# EAGLE design motor_dora (EAGLE 9.6.2)
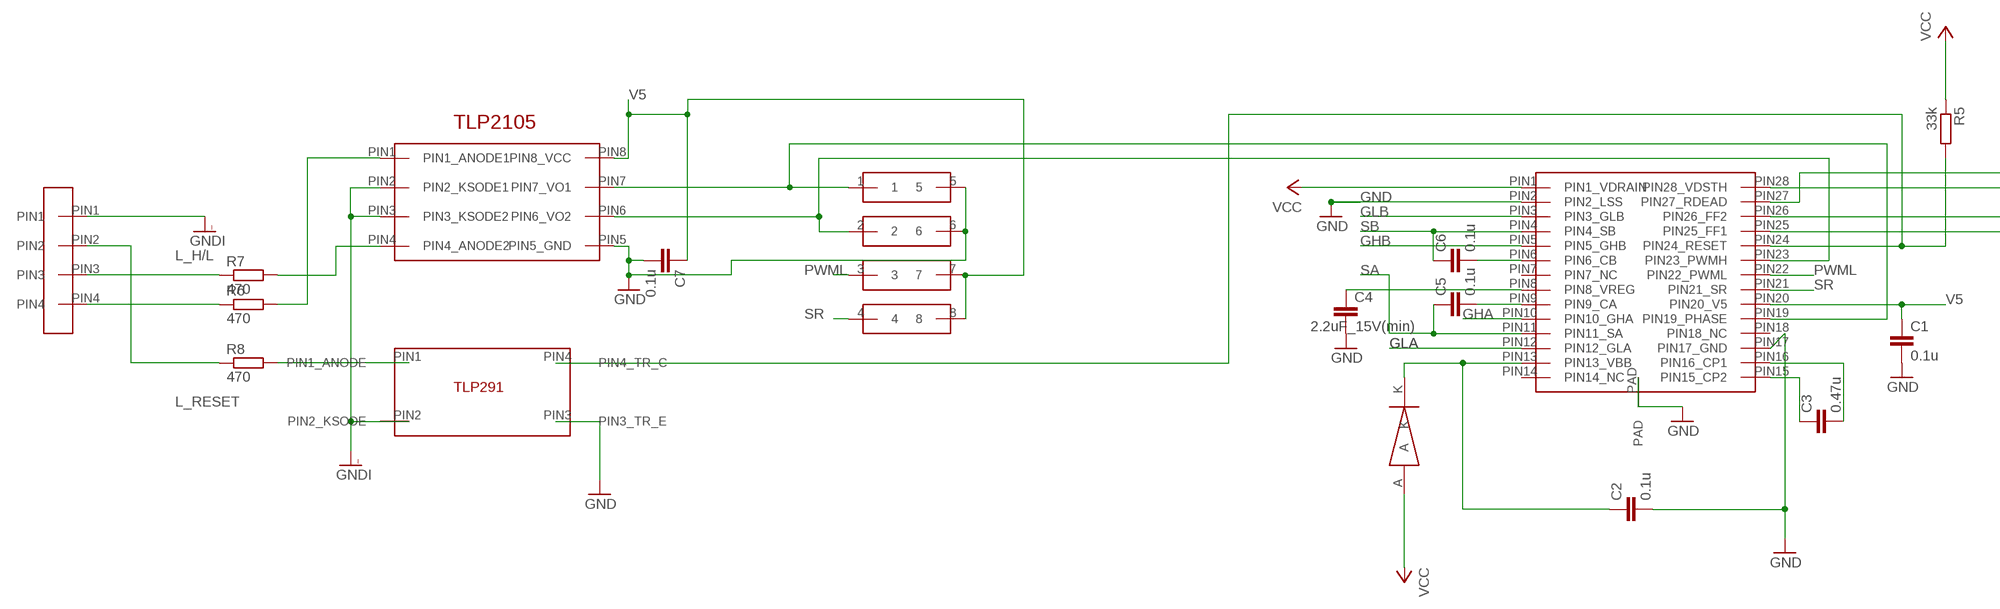
[diagram p0: schematic, sheet 1, part 1 of 2]
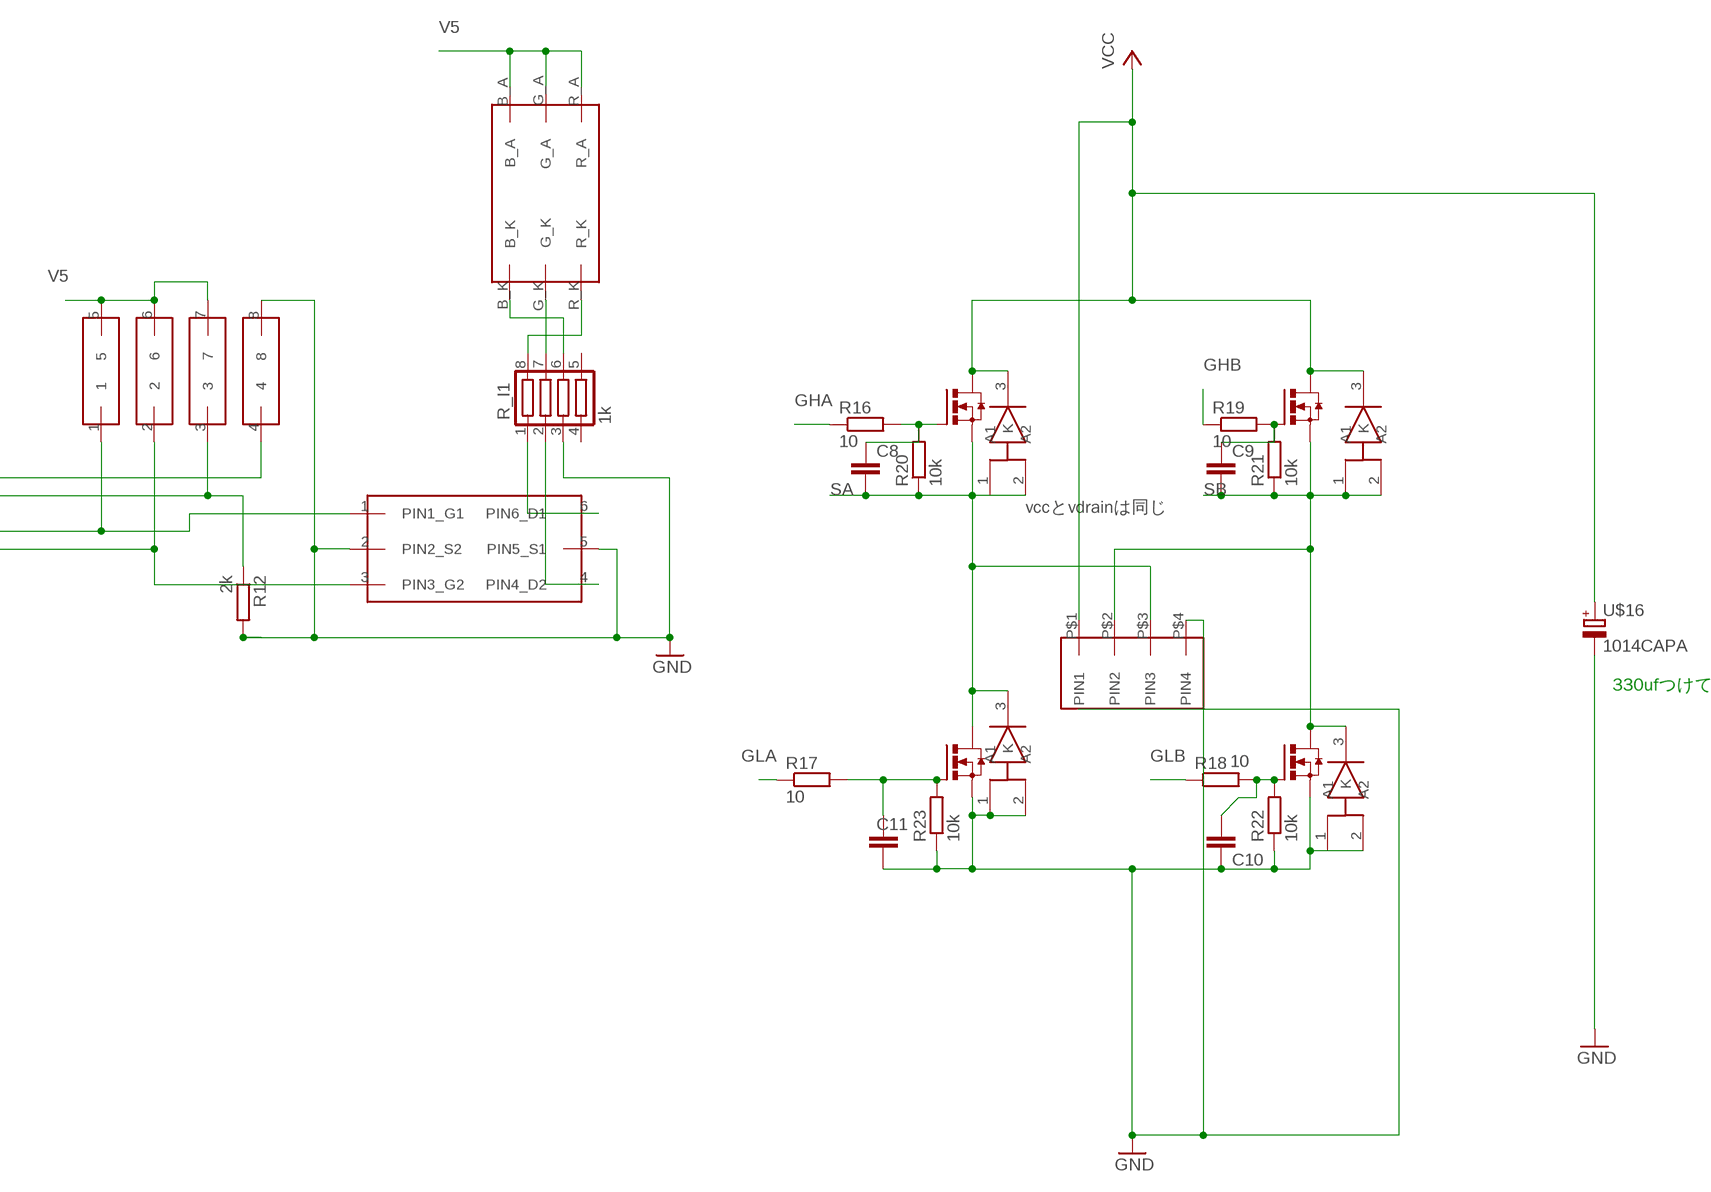
[diagram p1: schematic, sheet 1, part 2 of 2]

## Parts
C1  0.1u  C-EUC2012  [C2012]
C2  0.1u  C-EUC2012  [C2012]
C3  0.47u  C-EUC2012  [C2012]
C4  2.2uF_15V(min)  C-EUC2012  [C2012]
C5  0.1u  C-EUC2012  [C2012]
C6  0.1u  C-EUC2012  [C2012]
C7  0.1u  C-EUC2012  [C2012]
C8  C-EUC2012  [C2012]
C9  C-EUC2012  [C2012]
C10  C-EUC2012  [C2012]
C11  C-EUC2012  [C2012]
R5  33k  R-EU_R2012  [R2012]
R6  470  R-EU_R2012  [R2012]
R7  470  R-EU_R2012  [R2012]
R8  470  R-EU_R2012  [R2012]
R12  2k  R-EU_R2012  [R2012]
R16  10  R-EU_R2012  [R2012]
R17  10  R-EU_R2012  [R2012]
R18  10  R-EU_R2012  [R2012]
R19  10  R-EU_R2012  [R2012]
R20  10k  R-EU_R2012  [R2012]
R21  10k  R-EU_R2012  [R2012]
R22  10k  R-EU_R2012  [R2012]
R23  10k  R-EU_R2012  [R2012]
R_I1  1k  R_SHUGOU  [0603X4RESISTOR]
U$1  A3921  [A3921]
U$2  TLP2105  [TLP2105]
U$3  TLP291  [TLP291]
U$4  RGB_LED  [RGB_LED]
U$5  10k  1005X4RESISTOR  [1005X4RESISTOR]
U$6  10k  1005X4RESISTOR  [1005X4RESISTOR]
U$7  SBR10M100P5Q  [POWERDI_5]
U$8  IPD034N06N3G  [TO252]
U$9  IPD034N06N3G  [TO252]
U$10  IPD034N06N3G  [TO252]
U$11  IPD034N06N3G  [TO252]
U$12  SBR10M100P5Q  [POWERDI_5]
U$13  DF1B_L_4P  [DF1B_L_4P]
U$14  VL_4P  [VL_4P]
U$15  SBR10M100P5Q  [POWERDI_5]
U$16  1014CAPA  [1014CAPA]
U$17  SMD_DAIOD  [SMD_DAIOD]
U$18  SSOT6_FET  [SSOT6_FET]
U$19  SBR10M100P5Q  [POWERDI_5]

## Nets
GHA: R16.1 U$1.PIN10(PIN10_GHA)
GHB: R19.1 U$1.PIN5(PIN5_GHB)
GLA: R17.1 U$1.PIN12(PIN12_GLA)
GLB: R18.1 U$1.PIN3(PIN3_GLB)
GND: C1.2 C2.2 C4.2 C7.2 C10.2 C11.2 R12.2 R22.1 R23.1 R_I1.3 U$1.PAD U$1.PIN2(PIN2_LSS) U$1.PIN17(PIN17_GND) U$2.PIN5(PIN5_GND) U$3.PIN3(PIN3_TR_E) U$5.5 U$5.6 U$6.8 U$7.1(A1) U$7.2(A2) U$10.PIN3(PIN3_S) U$11.PIN3(PIN3_S) U$12.1(A1) U$12.2(A2) U$14.P$4(PIN4) U$16.- U$18.2(PIN2_S2) U$18.5(PIN5_S1)
GNDI: U$2.PIN2(PIN2_KSODE1) U$2.PIN3(PIN3_KSODE2) U$3.PIN2(PIN2_KSODE) U$13.PIN1
L_H/L: R7.1 U$13.PIN3
L_RESET: R8.1 U$13.PIN2
N$1: C2.1 U$1.PIN13(PIN13_VBB) U$17.K
N$2: R6.1 U$13.PIN4
N$3: R6.2 U$2.PIN1(PIN1_ANODE1)
N$4: C3.1 U$1.PIN15(PIN15_CP2)
N$5: U$1.PIN27(PIN27_RDEAD) U$6.4
N$6: R7.2 U$2.PIN4(PIN4_ANODE2)
N$7: R5.2 U$1.PIN24(PIN24_RESET) U$3.PIN4(PIN4_TR_C)
N$8: U$1.PIN23(PIN23_PWMH) U$2.PIN6(PIN6_VO2) U$5.2
N$9: U$1.PIN26(PIN26_FF2) U$6.1 U$18.1(PIN1_G1)
N$10: R8.2 U$3.PIN1(PIN1_ANODE)
N$11: C3.2 U$1.PIN16(PIN16_CP1)
N$12: U$1.PIN25(PIN25_FF1) U$6.2 U$18.3(PIN3_G2)
N$13: C4.1 U$1.PIN8(PIN8_VREG)
N$14: R_I1.7 U$4.G_K
N$15: R12.1 U$1.PIN28(PIN28_VDSTH) U$6.3
N$16: C6.2 U$1.PIN6(PIN6_CB)
N$17: C5.2 U$1.PIN9(PIN9_CA)
N$18: R_I1.2 U$18.4(PIN4_D2)
N$19: R_I1.8 U$4.R_K
N$20: R_I1.6 U$4.B_K
N$21: R_I1.1 U$18.6(PIN6_D1)
N$24: C8.1 R16.2 R20.2 U$8.PIN1(PIN1_G)
N$25: C9.1 R19.2 R21.2 U$9.PIN1(PIN1_G)
N$26: C11.1 R17.2 R23.2 U$10.PIN1(PIN1_G)
N$27: C10.1 R18.2 R22.2 U$11.PIN1(PIN1_G)
N$29: U$1.PIN19(PIN19_PHASE) U$2.PIN7(PIN7_VO1) U$5.1
PWML: U$1.PIN22(PIN22_PWML) U$5.3
SA: C5.1 C8.2 R20.1 U$1.PIN11(PIN11_SA) U$7.3(K) U$8.PIN3(PIN3_S) U$10.PIN2(PIN2_D) U$14.P$3(PIN3) U$19.1(A1) U$19.2(A2)
SB: C6.1 C9.2 R21.1 U$1.PIN4(PIN4_SB) U$9.PIN3(PIN3_S) U$11.PIN2(PIN2_D) U$12.3(K) U$14.P$2(PIN2) U$15.1(A1) U$15.2(A2)
SR: U$1.PIN21(PIN21_SR) U$5.4
V5: C1.1 C7.1 U$1.PIN20(PIN20_V5) U$2.PIN8(PIN8_VCC) U$4.B_A U$4.G_A U$4.R_A U$5.7 U$5.8 U$6.5 U$6.6 U$6.7
VCC: R5.1 U$1.PIN1(PIN1_VDRAIN) U$8.PIN2(PIN2_D) U$9.PIN2(PIN2_D) U$14.P$1(PIN1) U$15.3(K) U$16.+ U$17.A U$19.3(K)
Unconnected: R_I1.4 R_I1.5 U$1.PIN7(PIN7_NC) U$1.PIN14(PIN14_NC) U$1.PIN18(PIN18_NC)

## Notes on the sheet
- vccとvdrainは同じ
- 330ufつけて

## Library data of the parts
C1-C11 = rcl:C-EU: CAPACITOR, European symbol; SPICEPREFIX: C
R5-R8 R12 R16-R23 = rcl:R-EU_: RESISTOR, European symbol; SPICEPREFIX: R
R_I1 = user_rcl:R_SHUGOU
U$1 = user:A3921
U$2 = user:TLP2105
U$3 = user:TLP291
U$4 = user:RGB_LED
U$5 U$6 = user:1005X4RESISTOR
U$7 U$12 U$15 U$19 = user_diode:SBR10M100P5Q: digikeyに売ってるスーパーバリアダイオード 100V 10A
U$8-U$11 = user_tr_fet_igbt:IPD034N06N3G: 絶対最大定格：60V100A 買う場所：rsコンポーネンツ 通販コード：825-9168 値段が1つ160円くらいで高い！！！
U$13 = user:DF1B_L_4P
U$14 = user:VL_4P
U$16 = user:1014CAPA
U$17 = user:SMD_DAIOD
U$18 = user:SSOT6_FET

## Board
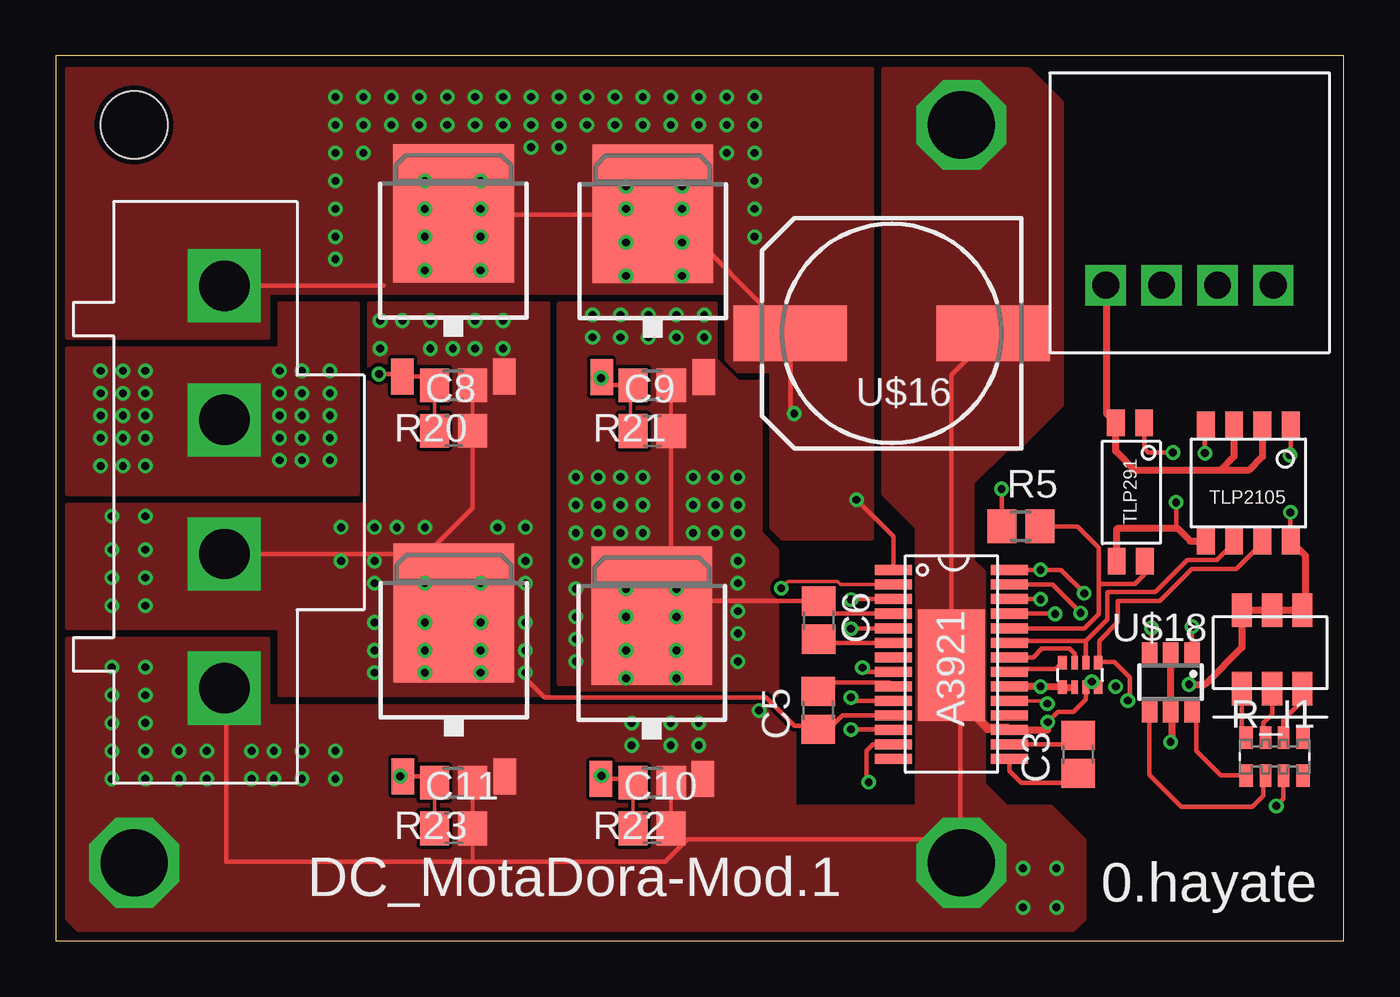
[diagram p2: board, top side]
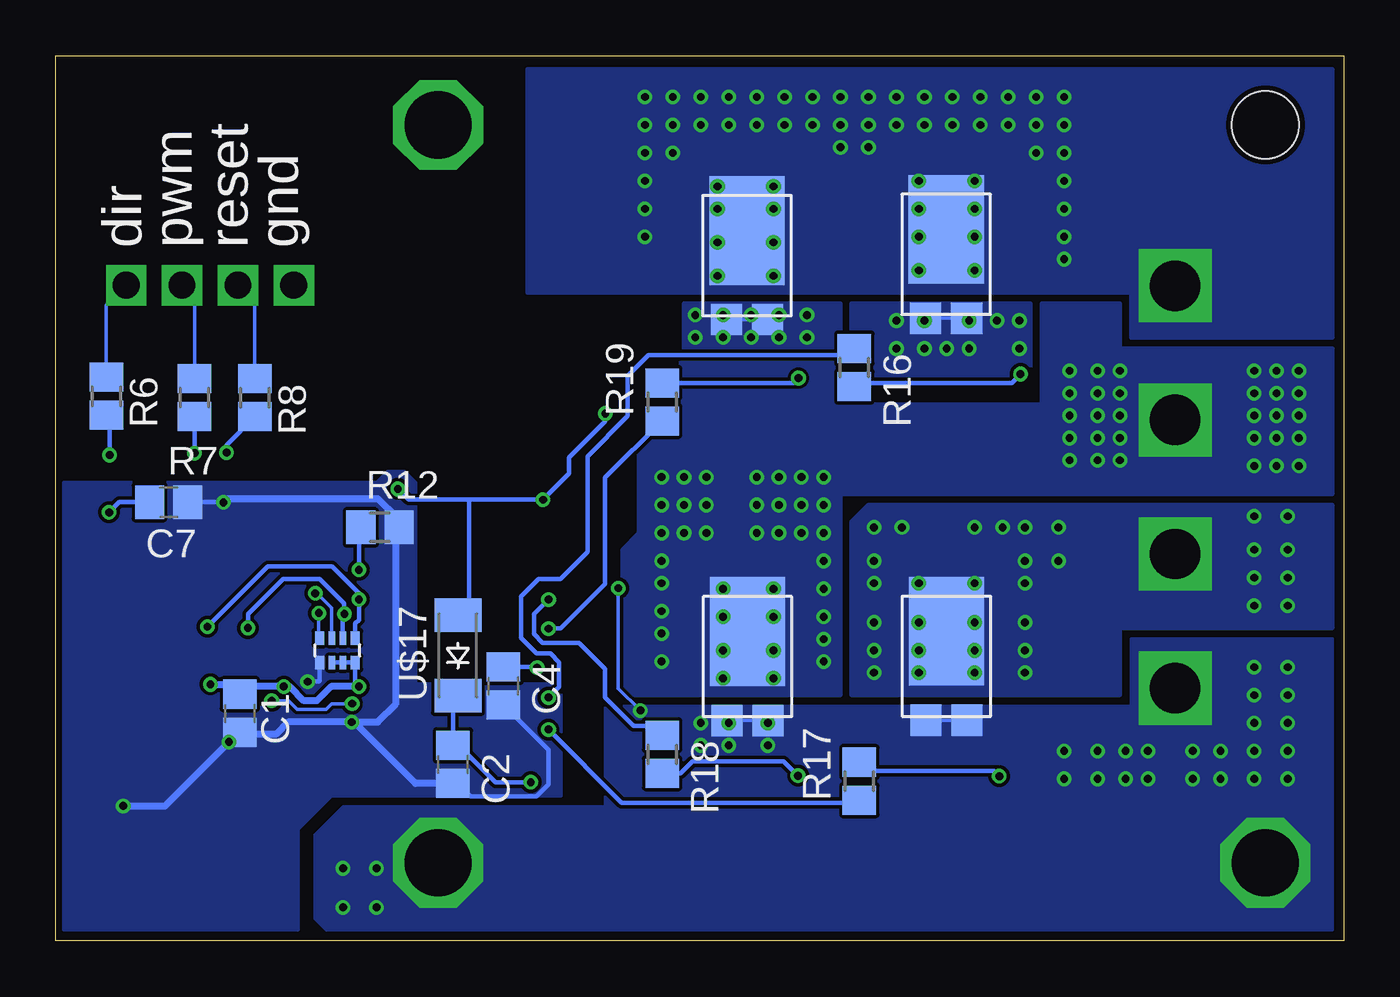
[diagram p3: board, bottom side, seen from below]

Size 57.59 x 39.59 mm. Coordinates in mm from the lower left corner, seen from the top.
Outline: 0,0 57.59,0 57.59,39.59 0,39.59 0,0
Copper layers (1*16): Top 0.035mm / dielectric 1.5mm / Bottom 0.035mm
Design rules "SeeedStudio_2layer_DRU_no_angle_20140221": minimum track width 6mil, minimum drill 12mil, track to track 6mil, track to pad 6mil, pad to pad 6mil, via to via 6mil, smd to smd 0mil, copper to edge 10mil, drill to drill 10mil, minimum pad ring 10mil, minimum via ring 6mil, stop-mask expansion 2mil, vias tented up to drill 100mil, thermal gap 10mil
Holes 3 mm at 3.5,36.5

### Footprints (pad centres in the part's own frame; a part is rotated, then mirrored left to right if it is on the bottom)
C2012 = smd 1.3 x 1.5: 1 -0.85,0; 2 0.85,0
R2012 = smd 1.3 x 1.5: 1 -0.85,0; 2 0.85,0
0603X4RESISTOR = smd 0.6 x 1: 1 -1.275,-0.85; 4 1.275,-0.85; 5 1.275,0.85; 8 -1.275,0.85 | smd 0.5 x 1: 2 -0.4,-0.85; 3 0.4,-0.85; 6 0.4,0.85; 7 -0.4,0.85
A3921 = smd 5 x 3: PAD 4.906,1.942 | smd 0.45 x 1.65: PIN1 0.65,-0.65; PIN2 1.3,-0.65; PIN3 1.95,-0.65; PIN4 2.6,-0.65; PIN5 3.25,-0.65; PIN6 3.9,-0.65; PIN7 4.55,-0.65; PIN8 5.2,-0.65; PIN9 5.85,-0.65; PIN10 6.5,-0.65; PIN11 7.15,-0.65; PIN12 7.8,-0.65; PIN13 8.45,-0.65; PIN14 9.1,-0.65; PIN15 9.1,4.55; PIN16 8.45,4.55; PIN17 7.8,4.55; PIN18 7.15,4.55; PIN19 6.5,4.55; PIN20 5.85,4.55; PIN21 5.2,4.55; PIN22 4.55,4.55; PIN23 3.9,4.55; PIN24 3.25,4.55; PIN25 2.6,4.55; PIN26 1.95,4.55; PIN27 1.3,4.55; PIN28 0.65,4.55
TLP2105 = smd 0.8 x 1.2: PIN1 0.65,-4.57; PIN2 1.92,-4.57; PIN3 3.19,-4.57; PIN4 4.46,-4.57; PIN5 4.46,0.62; PIN6 3.19,0.62; PIN7 1.92,0.62; PIN8 0.65,0.62
TLP291 = smd 1.2 x 0.8: PIN1 0.411,-0.862; PIN2 0.411,-2.132; PIN3 6.601,-2.092; PIN4 6.601,-0.822
RGB_LED = smd 1.5 x 0.9: B_A 3.5,-2.7; B_K 0,-2.7; G_A 3.5,-1.35; G_K 0,-1.35; R_A 3.5,0; R_K 0,0
1005X4RESISTOR = smd 0.4 x 0.6: 1 0.2,-0.8; 4 1.8,-0.8; 5 0.2,0.3; 8 1.8,0.3 | smd 0.3 x 0.6: 2 0.75,-0.8; 3 1.25,-0.8; 6 0.75,0.3; 7 1.25,0.3
POWERDI_5 = smd 1.39 x 1.4: 1 1.063,-0.177; 2 2.903,-0.177 | smd 3.36 x 4.86: 3 1.983,3.805
TO252 = smd 1 x 1.6: PIN1 -2.28,-4.8; PIN3 2.28,-4.8 | smd 5.4 x 6.2: PIN2 0,2.5
DF1B_L_4P = drill 1.2 square: PIN1 2.5,-9.5; PIN2 5,-9.5; PIN3 7.5,-9.5; PIN4 10,-9.5
VL_4P = drill 2.25 square: P$1 3.75,-3.25; P$2 9.75,-3.25; P$3 15.75,-3.25; P$4 21.75,-3.25
1014CAPA = smd 5.079 x 2.5: + 4.531,0; - -4.531,0
SMD_DAIOD = smd 1.5 x 2.1: A 1.8,0; K -1.8,0
SSOT6_FET = smd 0.69 x 0.99: 1 -0.95,-1.3; 2 0,-1.3; 3 0.95,-1.3; 4 0.95,1.3; 5 0,1.3; 6 -0.95,1.3

### Placement (x,y rotation side)
C1  49.37,10.19 270 bottom
C2  39.83,7.9 270 bottom
C3  45.72,8.35 90 top
C4  37.57,11.41 270 bottom
C5  34.1,10.31 90 top
C6  34.11,14.35 270 top
C7  52.55,19.63 0 bottom
C8  17.78,22.83 0 top
C9  26.67,22.81 0 top
C10  26.66,5.04 0 top
C11  17.78,5.04 0 top
R5  43.15,18.55 0 top
R6  55.33,24.37 270 bottom
R7  51.39,24.31 270 bottom
R8  48.69,24.3 270 bottom
R12  43.1,18.5 0 bottom
R16  21.88,25.65 270 bottom
R17  21.66,7.15 90 bottom
R18  30.48,8.35 270 bottom
R19  30.48,24.11 90 bottom
R20  17.78,24.86 180 top
R21  26.67,24.86 180 top
R22  26.67,7.08 180 top
R23  17.78,7.08 180 top
R_I1  54.5,8.25 0 top
U$1  38.1,17.24 270 top
U$2  55.88,18.51 180 top
U$3  49.53,23.59 270 top
U$4  53.04,11.29 90 top
U$5  46.81,11.65 180 top
U$6  44,12.75 180 bottom
U$7  19.75,10.05 0 bottom
U$8  17.78,30.05 0 top
U$9  26.69,30.02 0 top
U$10  17.8,12.17 0 top
U$11  26.65,12.05 0 top
U$12  28.64,10.04 0 bottom
U$13  44.45,38.83 0 top
U$14  10.78,33.06 270 top
U$15  28.67,27.97 0 bottom
U$16  37.38,27.18 180 top
U$17  39.61,12.77 90 bottom
U$18  49.86,11.57 180 top
U$19  19.76,28.03 0 bottom

### Tracks (layer width: path | path; a pad name or v marks a point on that pad's centre or on a via)
GHA  (via drill 0.35)
  Top 0.2: U$1.PIN10 35.71,10.74 v35.56,10.89
  Bottom 0.2: R16.1 22.18,26.2 31.09,26.2 32.02,25.27 32.02,23.47 33.81,21.68 33.81,17.4 35.02,16.19 36.01,16.19 36.79,15.41 36.79,13.56 36.08,12.85 35.47,12.85 35.08,12.46 35.08,11.37 v35.56,10.89
GHB  (via drill 0.35)
  Top 0.2: U$1.PIN5 35.58,13.99 v35.56,13.97
  Bottom 0.2: R19.1 33.02,20.72 33.02,15.97 35.02,13.97 v35.56,13.97
GLA  (via drill 0.35)
  Top 0.2: U$1.PIN12 37.43,9.46 v35.56,9.46
  Bottom 0.2: R17.1 21.77,6.19 32.29,6.19 v35.56,9.46
GLB  (via drill 0.35)
  Top 0.2: U$1.PIN3 35.58,15.29 v35.56,15.27
  Bottom 0.2: v35.56,15.27 36.21,14.62 36.21,13.73 35.82,13.34 34.2,13.34 33.02,12.16 33.02,10.89 31.75,9.62 30.9,9.62 R18.1
GND  (via drill 0.35, 3)
  Top 0.152: R22.1 C10.2 28.01,4.54 28.25,4.54 | R23.1 C11.2 18.63,3.66 18.75,3.54 | U$5.5 46.36,11.6 v46.33,11.6 46.31,11.6 U$5.6 | U$1.PIN2 35.09,15.94 34.95,16.08 32.74,16.08 v32.44,15.78
  Top 0.2: v50.1,19.62 50.1,18.52 50.18,18.44 | U$16.- 40.04,25.31 40.04,14.5 40.04,12.5 | 40.04,12.5 40.04,12.16 | U$14.P$4 7.62,11.22 7.62,3.54 18.75,3.54 27.25,3.54 28.25,4.54 40.46,4.54 40.46,12.08 40.04,12.5
  Top 0.203: R_I1.3 54.9,6.36 v54.58,6.04 | v44.36,9.79 44.82,10.25 45.51,10.25 46.06,10.8 U$5.6
  Top 0.305: U$1.PIN17 44.36,9.44 v44.36,9.79 | U$2.PIN5 50.73,17.89 50.18,18.44 47.45,18.44 47.44,18.43 U$3.PIN3 | v49.85,8.9 49.9,8.95 49.9,10.23 U$18.5 U$18.2
  Top 0.406: U$1.PIN17 42.58,9.51 41.68,9.51 40.04,11.14 40.04,12.16 U$1.PAD
  Bottom 0.152: U$7.2 U$7.1 | U$12.2 U$12.1 | v32.44,15.78 32.44,11.3 v31.45,10.31
  Bottom 0.2: C7.2 v50.11,19.63 v50.1,19.62 | C4.2 35.56,8.55 35.56,7 36.09,6.47 39.05,6.47 39.63,7.05 C2.2
  Bottom 0.203: v46.33,11.6 45.83,11.6 45.8,11.63 U$6.8
  Bottom 0.305: 44.25,9.79 v44.36,9.79 47.21,9.79 47.75,9.25 49.28,9.25 C1.2 49.81,8.9 v49.85,8.9 52.71,6.04 v54.58,6.04 | 44.25,9.79 43.2,9.79 42.4,10.59 42.4,18.44 | R12.2 42.4,18.44 | 42.4,18.44 42.4,19 43.18,19.78 49.96,19.78 v50.11,19.63 | C2.2 41.51,7.05 44.25,9.79
  other vias: 40.5,3.5 3.5,3.5 40.5,36.5 2.5,12.25 2.5,11 2.5,9.75 2.5,8.5 2.5,7.25 4,12.25 4,11 4,9.75 4,8.5 4,7.25 5.5,8.5 6.75,8.5 6.75,7.25 5.5,7.25 9.75,8.5 9.75,7.25 11,7.25 11,8.5 12.5,8.5 12.5,7.25 8.75,7.25 8.75,8.5 25.75,9.75 27.5,9.75 25.75,8.75 27.5,8.75 28.75,8.75 28.75,9.75 43.25,3.25 44.75,3.25 44.75,1.5 43.25,1.5
  pour Top (no thermals): 9.5,13.5 0.5,13.5 0.5,1 1,0.5 45.5,0.5 46,1 46,4.5 44.5,6 42.5,6 41.5,7 41.5,16.5 41,17 41,20.5 42.5,22 43,22 45,24 45,37.5 43.5,39 37,39 37,20 38.5,18.5 38.5,6 33,6 33,10.5 9.5,10.5
  pour Bottom (no thermals): 0.5,13.5 0.5,0.5 45.5,0.5 45.75,0.75 46,1 46,4.75 44.75,6 44.5,6 42.5,6 33,6 33,9.5 33,10.5 9.5,10.5 9.5,13.5
  pour Bottom (no thermals): 46.75,0.5 57.25,0.5 57.25,20.5 43.25,20.5 42.75,21 42,21 41.5,20.5 41.5,11.5 35,11.5 35,6.5 45.25,6.5 46.75,5
GNDI
  Top 0.305: U$2.PIN3 52.69,21.67 52.07,21.05 | 52.07,21.05 48.26,21.05 47.4,21.91 U$3.PIN2 46.99,23.59 46.99,29.29 U$13.PIN1 | U$2.PIN2 53.96,21.67 53.34,21.05 52.07,21.05
L_H/L
  Bottom 0.152: U$13.PIN3 51.39,28.77 R7.1
L_RESET
  Bottom 0.152: U$13.PIN2 48.69,28.57 R8.1
N$1  (via drill 0.35)
  Top 0.2: v36.35,7.1 36.26,7.19 36.26,8.5 36.55,8.79 U$1.PIN13
  Bottom 0.2: v36.35,7.1 37.93,7.1 39.58,8.75 C2.1 39.83,10.75 U$17.K
N$2
  Bottom 0.152: U$13.PIN4 55.33,28.45 R6.1
N$3  (via drill 0.35)
  Top 0.2: U$2.PIN1 55.23,21.78 v55.19,21.74
  Bottom 0.2: R6.2 55.19,23.38 v55.19,21.74
N$4
  Top 0.2: C3.1 45.3,7.08 43.18,7.08 42.65,7.61 U$1.PIN15
N$5  (via drill 0.35)
  Top 0.2: v45.83,14.67 44.56,15.94 U$1.PIN27
  Bottom 0.152: v45.83,14.67 45.83,13.58 U$6.4
N$6  (via drill 0.35)
  Top 0.2: v51.39,21.82 51.39,23.05 U$2.PIN4
  Bottom 0.2: R7.2 v51.39,21.82
N$7
  Top 0.2: U$1.PIN24 45.71,13.99 45.72,13.98 45.99,13.98 46.64,14.63 46.64,15.96 46.65,15.97 | 46.65,15.97 48.26,15.97 48.71,16.42 U$3.PIN4 | R5.2 45.68,18.55 46.65,17.58 46.65,15.97
N$8
  Top 0.2: U$2.PIN6 52.69,17.8 51.92,17.04 50.6,17.04 49.18,15.62 47.05,15.62 47.02,15.59 47.02,14.39 46.06,13.43 | U$1.PIN23 42.74,13.43 46.06,13.43 | 46.06,13.43 46.06,12.75 46.06,12.49 U$5.2
N$9  (via drill 0.35)
  Top 0.2: U$1.PIN26 v44.03,15.29 v44.04,15.28 | v50.81,14.06 U$18.1
  Bottom 0.2: v50.81,14.06 48.12,16.75 45.24,16.75 44.04,15.55 v44.04,15.28 v44.03,15.27 44.03,14.37 44.2,14.2 U$6.1
N$10  (via drill 0.35)
  Top 0.2: v49.96,21.85 48.86,21.85 48.67,22.04 U$3.PIN1
  Bottom 0.2: R8.2 49.96,22.18 v49.96,21.85
N$11
  Top 0.2: U$1.PIN16 43.74,8.79 45.31,8.79 C3.2
N$12  (via drill 0.35)
  Top 0.152: v49,14 49,12.96 U$18.3
  Top 0.2: U$1.PIN25 v44.68,14.64 v44.69,14.63
  Bottom 0.2: v49,14 49,14.62 47.42,16.2 45.8,16.2 44.69,15.09 v44.69,14.63 44.76,14.56 U$6.2
N$13  (via drill 0.35)
  Top 0.2: U$1.PIN8 36.25,12.04 v36.07,12.22
  Bottom 0.2: C4.1 36.11,12.26 v36.07,12.22
N$14
  Top 0.203: U$4.G_K 54.39,10.14 54,9.75 54,9.2 R_I1.7
N$15  (via drill 0.35)
  Top 0.2: U$1.PIN28 v44.03,16.59 v44.04,16.6 44.95,16.6 v45.99,15.56 v45.99,15.55
  Bottom 0.152: U$6.3 45.25,14.89 45.91,15.55 v45.99,15.55
  Bottom 0.2: v44.04,16.6 44.04,18.41 R12.1
N$16
  Top 0.2: U$1.PIN6 34.27,13.34 C6.2
N$17
  Top 0.2: U$1.PIN9 37.28,11.56 34.5,11.56 C5.2
N$18
  Top 0.152: 54,7.3 R_I1.2
  Top 0.2: U$18.4 48.91,7.43 50.34,6 53.34,6
  Top 0.203: 53.34,6 53.5,6 54,6.5 54,7.3
N$19
  Top 0.203: U$4.R_K 53.04,9.29 R_I1.8
N$20
  Top 0.203: U$4.B_K 55.74,10.74 54.9,9.9 R_I1.6
N$21
  Top 0.203: U$18.6 51,10.08 51,8.5 52.1,7.4 R_I1.1
N$24  (via drill 0.35)
  Top 0.152: R20.2 16.93,24.75 C8.1
  Top 0.2: v14.45,25.36 15.39,25.36 U$8.PIN1 16.43,25.25 16.93,24.75
  Bottom 0.2: R16.2 21.71,24.96 14.85,24.96 v14.45,25.36
N$25  (via drill 0.35)
  Top 0.152: C9.1 25.82,22.85 25.69,22.97 25.69,24.73 R21.2
  Top 0.2: R21.2 24.5,24.86 24.27,25.09 U$9.PIN1 v24.38,25.19 v24.38,25.18
  Bottom 0.2: R19.2 24.6,24.96 v24.38,25.18
N$26  (via drill 0.35)
  Top 0.152: R23.2 16.93,7 C11.1
  Top 0.2: v15.4,7.37 v15.41,7.36 U$10.PIN1 16.56,7.37 16.93,7
  Bottom 0.2: R17.2 21.28,7.62 15.65,7.62 v15.4,7.37
N$27  (via drill 0.35)
  Top 0.152: R22.2 C10.1
  Top 0.2: R22.2 25.65,7.25 U$11.PIN1 24.4,7.28 v24.4,7.39
  Bottom 0.2: R18.2 29.66,7.5 29.12,8.04 25.05,8.04 v24.4,7.39
N$29  (via drill 0.35)
  Top 0.152: U$1.PIN19 44.22,10.74 v44.34,10.62 | v47.94,10.75
  Top 0.2: U$2.PIN7 53.96,17.8 52.8,16.64 50.81,16.64 49.38,15.21 47.5,15.21 47.49,15.2 47.49,14.26 46.66,13.43 46.66,12.5 U$5.1 46.65,12.49 47.34,12.49 48.04,11.79 48.04,10.85 v47.94,10.75
  Bottom 0.152: v44.34,10.62 45.27,10.62 45.51,10.37 46.81,10.37 47.19,10.75 v47.94,10.75
PWML
  Top 0.2: U$1.PIN22 43.71,12.69 44.1,13.08 45.32,13.08 45.56,12.84 U$5.3
SA  (via drill 0.35)
  Top 0.152: R20.1 18.63,23
  Top 0.2: C5.1 34.26,9.62 | U$1.PIN11 35.17,10.09 34.7,9.62 34.26,9.62 | U$14.P$3 16.58,17.31 18.63,19.36 18.63,23 | 34.26,9.62 33.02,9.62 31.75,10.89 21.86,10.89 21,11.75 v21,12
  Bottom 0.152: 18.5,27.85 U$19.2
  Bottom 0.2: 18.5,27.85 U$19.1 18.75,27.8 v18.75,27.75
  other vias: 2.5,19 2.5,17.5 2.5,16.25 2.5,15 4,16.25 4,15 12.75,18.5 12.75,17 14.25,16 14.25,14.25 14.25,13 14.25,12 16.5,12 16.5,13 16.5,14.25 16.5,16 14.25,17 14.25,18.5 15.25,18.5 16.5,18.5 19.75,18.5 21,18.5 19,16 19,14.25 19,13 19,12 21,13 21,14.25 21,16 21,17 4,19 4,17.5 14.5,27.75 15.5,27.75 16.75,27.75 20,27.75 20,26.5 18.75,26.5 17.75,26.5 16.75,26.5 14.5,26.5
  pour Top (no thermals): 0.5,19.5 14,19.5 14,28.5 22,28.5 22,11 10,11 10,14 0.5,14
  pour Bottom (no thermals): 0.5,19.5 21.25,19.5 22,18.75 22,11 10,11 10,14 0.5,14
  pour Bottom (no thermals): 14,28.5 22,28.5 22,24.42 14,24.42
SB  (via drill 0.35)
  Top 0.152: R21.1 27.52,23
  Top 0.2: U$1.PIN4 34.67,14.64 C6.1 27.21,15.2 | 27.52,23 27.52,15.51
  Bottom 0.152: U$15.2 U$15.1
  other vias: 2,25.5 2,24.5 2,23.5 2,22.5 2,21.25 3,21.25 3,22.5 3,23.5 3,24.5 3,25.5 4,25.5 4,24.5 4,23.5 4,22.5 4,21.25 10,25.5 10,24.5 10,23.5 10,22.5 10,21.5 11,21.5 11,22.5 11,23.5 11,24.5 11,25.5 12.25,24.5 12.25,23.5 12.25,22.5 12.25,21.5 25.25,20.75 26.25,20.75 25.25,19.5 26.25,18.25 24.25,19.5 24.25,18.25 23.25,14.5 23.25,15.75 23.25,19.5 23.25,18.25 26.25,19.5 12.25,25.5 23.25,20.75 24.25,20.75 30.5,20.75 23.25,12.5 29.5,20.75 28.5,20.75 28.5,19.5 29.5,19.5 30.5,19.5 30.5,18.25 29.5,18.25 28.5,18.25 25.25,18.25 30.5,14.75 30.5,16 30.5,17 27.75,15.75 23.25,13.5 30.5,13.75 30.5,12.5 27.75,11.75 27.75,13 27.75,14.5 23.25,17 25.5,15.75 25.5,14.5 25.5,13 25.5,11.75 29,28 29,27 27.75,27 27.75,28 26.5,28 26.5,27 25.25,28 25.25,27 24,27 24,28
  pour Top (no thermals): 0.5,26.5 10,26.5 10,28.5 13.5,28.5 13.5,20 0.5,20
  pour Top (no thermals): 22.5,11.5 22.5,28.5 29.5,28.5 29.5,26 30.5,25 31.5,25 31.5,18.25 32.25,17.5 32.25,11 23.5,11 23.5,11.5
  pour Bottom (no thermals): 0.5,26.5 0.5,20 22.5,20 22.5,11 32.25,11 32.25,17.5 31.5,18.25 31.5,25 30.5,25 29.5,26 29.5,28.5 22.5,28.5 22.5,24 13.5,24 13.5,28.5 10,28.5 10,26.5
SR
  Top 0.2: U$1.PIN21 42.77,12.16 44.72,12.16 U$5.4
V5  (via drill 0.35)
  Top 0.2: v55.21,19.17 55.21,17.91 U$2.PIN8
  Top 0.305: U$2.PIN8 55.88,17.24 55.88,14.93 U$4.B_A U$4.G_A U$4.R_A 53.04,13.12 51.4,11.48 v50.68,11.48 | U$1.PIN20 v44.04,11.38 44.98,11.38 U$5.8 U$5.7
  Bottom 0.2: v55.21,19.17 54.75,19.63 C7.1 | U$6.6 U$6.5 44.2,11.54 v44.04,11.38
  Bottom 0.203: U$6.6 U$6.7
  Bottom 0.305: v50.68,11.48 49.81,11.48 C1.1 49.03,11.38 v47.4,11.38 47.13,11.38 46.5,10.75 45.92,10.75 45.29,11.38 v44.04,11.38
VCC  (via drill 0.35)
  Top 0.2: U$14.P$1 14.65,29.31 | 17.82,32.48 27.55,32.48 U$16.+ 32.85,23.76 v33.02,23.59 | v35.81,19.74 37.45,18.1 U$1.PIN1 | R5.1 v42.3,20.22
  Bottom 0.2: 39.11,19.74 v35.81,19.74 34.64,20.91 34.64,21.62 33.02,23.24 v33.02,23.59 | v42.3,20.22 41.82,19.74 39.11,19.74 | 39.11,19.74 39.11,15.07 U$17.A
  other vias: 12.5,37.75 12.5,36.5 12.5,35.25 12.5,34 12.5,32.75 12.5,31.5 12.5,30.5 16.5,30 16.5,31.5 16.5,32.75 16.5,34 13.75,35.25 13.75,36.5 13.75,37.75 15,37.75 15,36.5 16.25,36.5 16.25,37.75 17.5,37.75 17.5,36.5 18.75,36.5 18.75,37.75 20,37.75 20,36.5 21.25,36.5 21.25,37.75 21.25,35.5 19,34 19,32.75 19,31.5 19,30 25.5,29.75 25.5,31.25 25.5,32.75 25.5,33.75 22.5,35.5 22.5,36.5 22.5,37.75 23.75,37.75 23.75,36.5 25,36.5 25,37.75 26.25,37.75 26.25,36.5 28.75,36.5 28.75,37.75 27.5,37.75 27.5,36.5 30,37.75 30,36.5 30,35.25 28,33.75 28,32.75 28,31.25 28,29.75 31.25,31.5 31.25,32.75 31.25,34 31.25,35.25 31.25,36.5 31.25,37.75
  pour Top (no thermals): 9.5,27 0.5,27 0.5,39 36.5,39 36.5,18 32.5,18 32,18.5 32,25.5 30.5,25.5 30,26 30,29 9.5,29
  pour Bottom (no thermals): 9.5,27 0.5,27 0.5,39 36.5,39 36.5,29 9.5,29

### Text on the board
tNames: DC_MotaDora-Mod.1 | 0.hayate
bNames: gnd | reset | pwm | dir